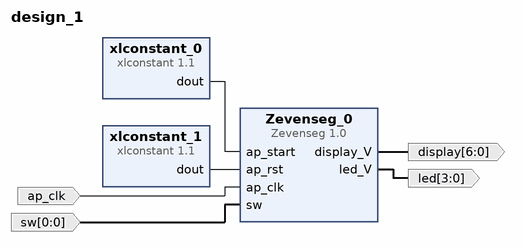
[diagram p0: block diagram of the top level]
# Vivado block design design_1, xc7z010clg400-1, Vivado 2016.4
create_bd_design design_1

create_bd_port -dir I -type clk ap_clk
create_bd_port -dir I -from 0 -to 0 -type data sw
set_property -dict [list \
  CONFIG.LAYERED_METADATA {xilinx.com:interface:datatypes:1.0 {DATA {datatype {name {attribs {resolve_type immediate dependency {} format string minimum {} maximum {}} value {}} bitwidth {attribs {resolve_type immediate dependency {} format long minimum {} maximum {}} value 1} bitoffset {attribs {resolve_type immediate dependency {} format long minimum {} maximum {}} value 0} integer {signed {attribs {resolve_type immediate dependency {} format bool minimum {} maximum {}} value false}}}}}} \
] [get_bd_ports sw]
create_bd_port -dir O -from 3 -to 0 -type data led
create_bd_port -dir O -from 6 -to 0 -type data display

create_bd_cell -type ip -vlnv xilinx.com:ip:xlconstant:1.1 xlconstant_0
create_bd_cell -type ip -vlnv xilinx.com:ip:xlconstant:1.1 xlconstant_1
set_property -dict {CONFIG.CONST_VAL 0} [get_bd_cells xlconstant_1]
create_bd_cell -type ip -vlnv xilinx.com:hls:Zevenseg:1.0 Zevenseg_0

# ---- connections ----

connect_bd_net [get_bd_pins xlconstant_0/dout] [get_bd_pins Zevenseg_0/ap_start]
connect_bd_net [get_bd_ports ap_clk] [get_bd_pins Zevenseg_0/ap_clk]
connect_bd_net [get_bd_ports sw] [get_bd_pins Zevenseg_0/sw]
connect_bd_net [get_bd_pins xlconstant_1/dout] [get_bd_pins Zevenseg_0/ap_rst]
connect_bd_net [get_bd_pins Zevenseg_0/led_V] [get_bd_ports led]
connect_bd_net [get_bd_pins Zevenseg_0/display_V] [get_bd_ports display]

validate_bd_design
save_bd_design
